# EAGLE design sdr_boosterpack (EAGLE 7.2.0)
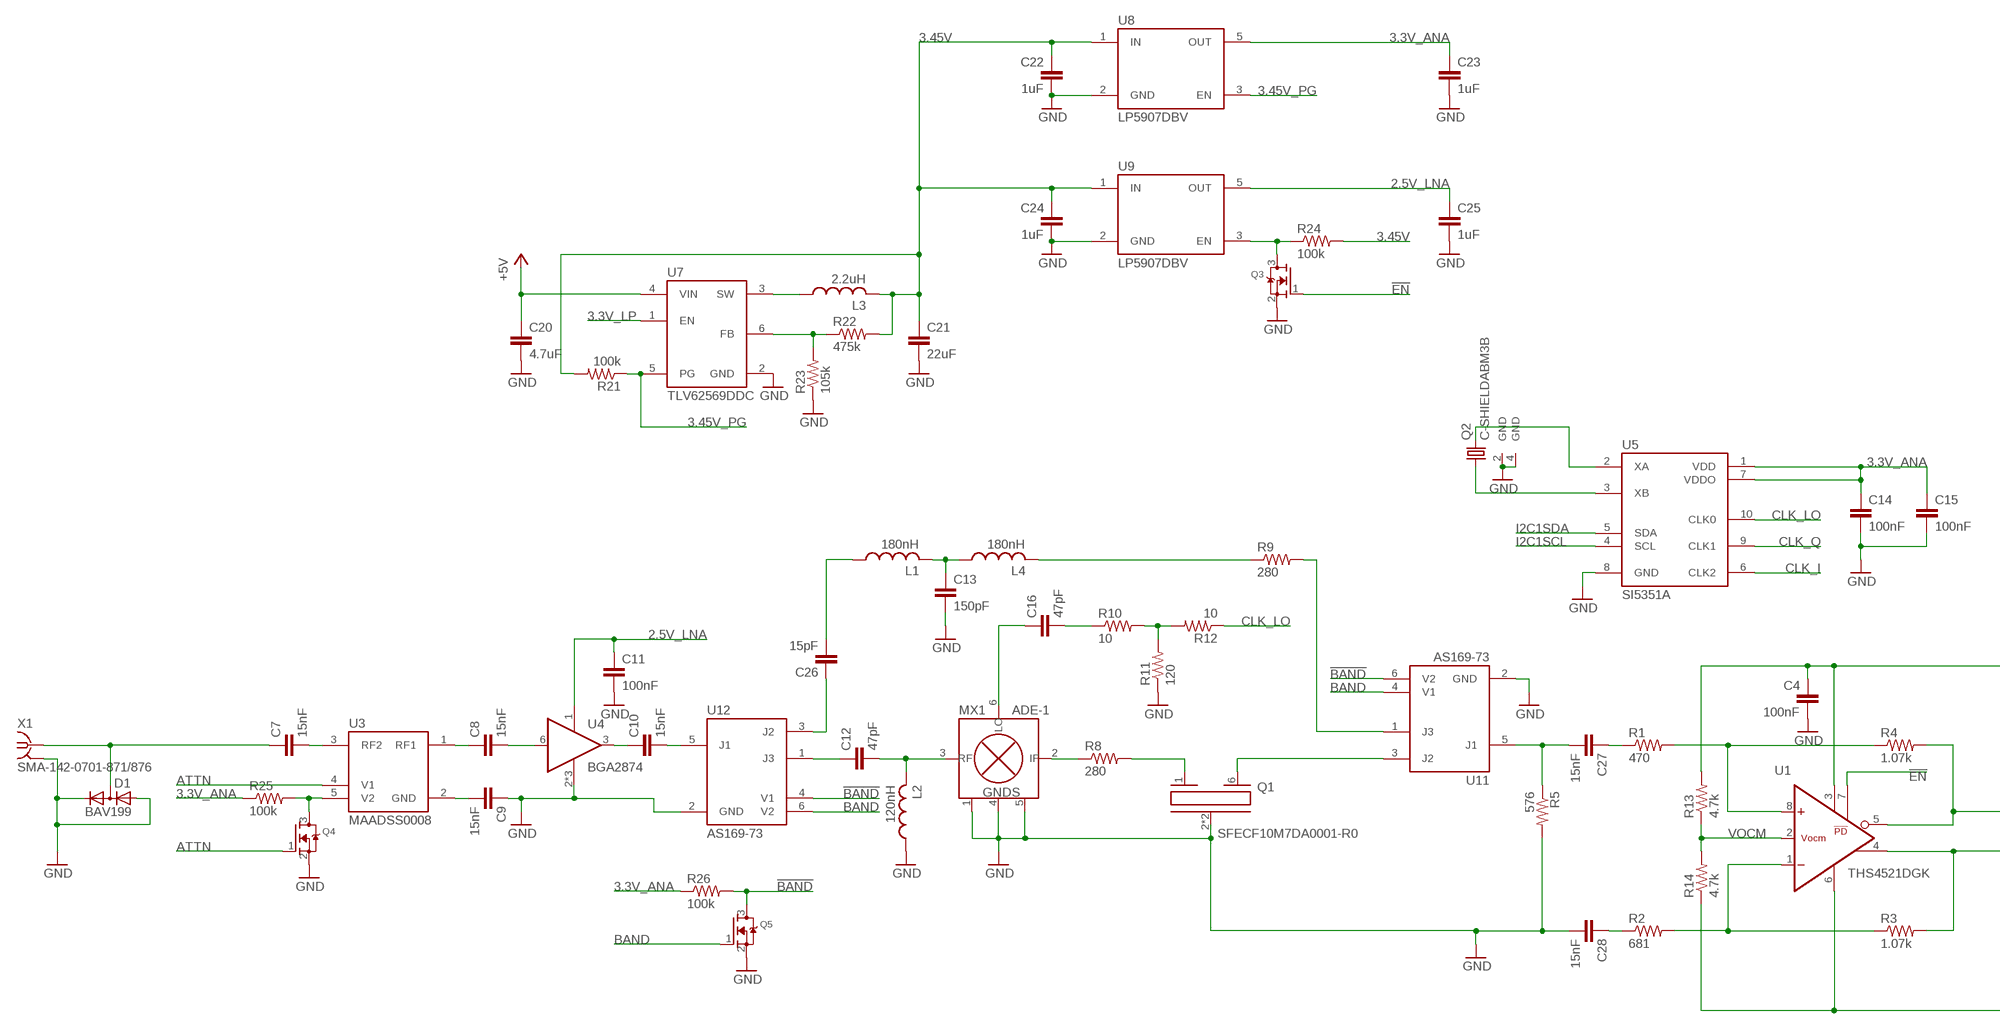
[diagram p0: schematic, sheet 1, part 1 of 2]
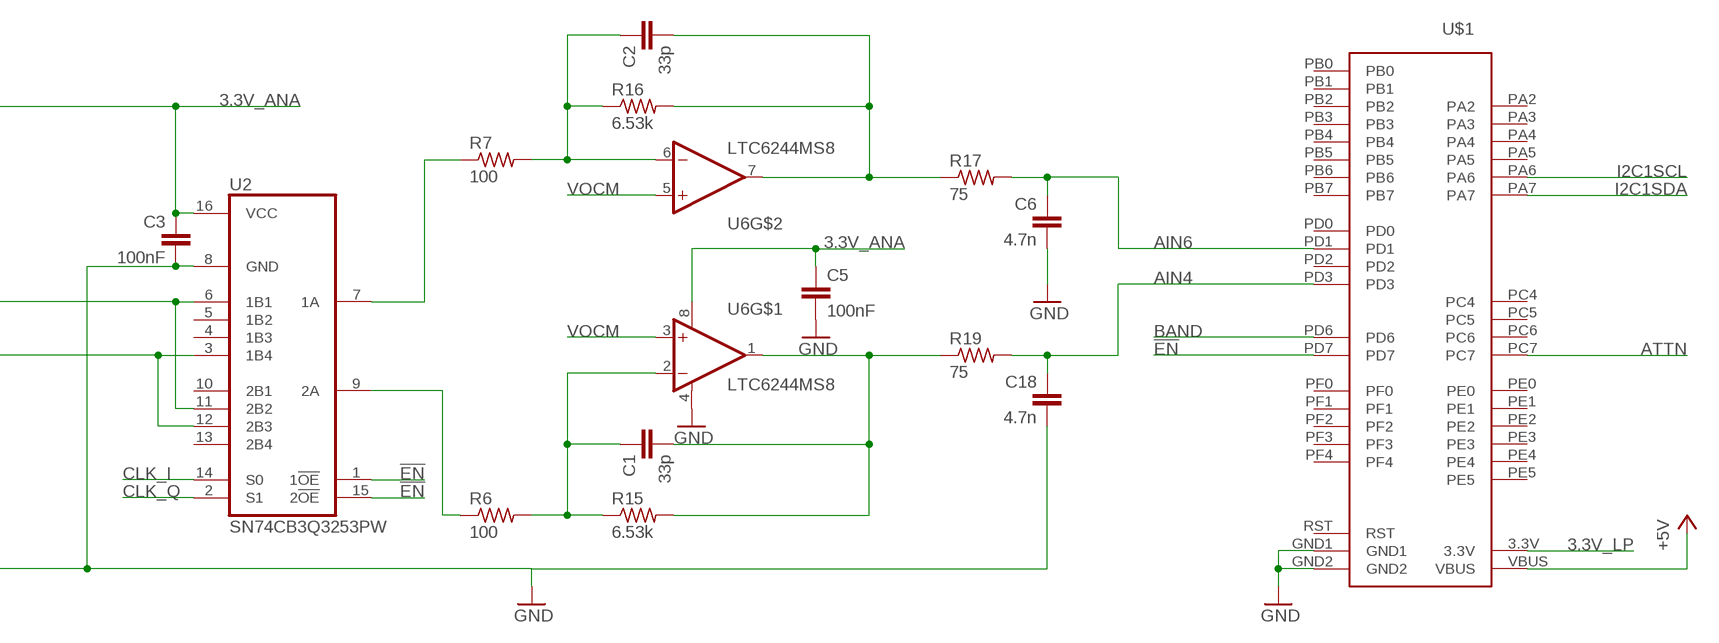
[diagram p1: schematic, sheet 1, part 2 of 2]

## Parts
C1  33p  C-EUC0603  [C0603]
C2  33p  C-EUC0603  [C0603]
C3  100nF  C-EUC0603  [C0603]
C4  100nF  C-EUC0603  [C0603]
C5  100nF  C-EUC0603  [C0603]
C6  4.7n  C-EUC0603  [C0603]
C7  15nF  C-EUC0603  [C0603]
C8  15nF  C-EUC0603  [C0603]
C9  15nF  C-EUC0603  [C0603]
C10  15nF  C-EUC0603  [C0603]
C11  100nF  C-EUC0603  [C0603]
C12  47pF  C-EUC0603  [C0603]
C13  150pF  C-EUC0603  [C0603]
C14  100nF  C-EUC0603  [C0603]
C15  100nF  C-EUC0603  [C0603]
C16  47pF  C-EUC0603  [C0603]
C18  4.7n  C-EUC0603  [C0603]
C20  4.7uF  C-EUC0805  [C0805]
C21  22uF  C-EUC0805  [C0805]
C22  1uF  C-EUC0805  [C0805]
C23  1uF  C-EUC0805  [C0805]
C24  1uF  C-EUC0805  [C0805]
C25  1uF  C-EUC0805  [C0805]
C26  15pF  C-EUC0603  [C0603]
C27  15nF  C-EUC0603  [C0603]
C28  15nF  C-EUC0603  [C0603]
D1  BAV199  [SOT23]
L1  180nH  L-US0603CS  [C0603]
L2  120nH  L-US0603CS  [C0603]
L3  2.2uH  L-USXAL4040  [XAL4040]
L4  180nH  L-US0603CS  [C0603]
MX1  ADE-1  [CD636]
Q1  SFECF10M7DA0001-R0  SFECF  [SFECF]
Q2  C-SHIELDABM3B  [ABM3B]
Q3  MOSFET-NREFLOW  [SOT23]
Q4  MOSFET-NREFLOW  [SOT23]
Q5  MOSFET-NREFLOW  [SOT23]
R1  470  R-US_R0603  [R0603]
R2  681  R-US_R0603  [R0603]
R3  1.07k  R-US_R0603  [R0603]
R4  1.07k  R-US_R0603  [R0603]
R5  576  R-US_R0603  [R0603]
R6  100  R-US_R0603  [R0603]
R7  100  R-US_R0603  [R0603]
R8  280  R-US_R0603  [R0603]
R9  280  R-US_R0603  [R0603]
R10  10  R-US_R0603  [R0603]
R11  120  R-US_R0603  [R0603]
R12  10  R-US_R0603  [R0603]
R13  4.7k  R-US_R0603  [R0603]
R14  4.7k  R-US_R0603  [R0603]
R15  6.53k  R-US_R0603  [R0603]
R16  6.53k  R-US_R0603  [R0603]
R17  75  R-US_R0603  [R0603]
R19  75  R-US_R0603  [R0603]
R21  100k  R-US_R0603  [R0603]
R22  475k  R-US_R0603  [R0603]
R23  105k  R-US_R0603  [R0603]
R24  100k  R-US_R0603  [R0603]
R25  100k  R-US_R0603  [R0603]
R26  100k  R-US_R0603  [R0603]
U1  THS4521DGK  [DGK_S-PDSO-G8]
U2  SN74CB3Q3253PW  [PW_R-PDSO-G16]
U3  MAADSS0008  [SOT23-5L]
U4  BGA2874  [SOT363_PHILIPS]
U5  SI5351A  [MSOP10]
U6  LTC6244MS8  [MSOP8]
U7  TLV62569DDC  [SOT23-6]
U8  LP5907DBV  [MF05A-M]
U9  LP5907DBV  [MF05A-M]
U11  AS169-73  [SOT23-6]
U12  AS169-73  [SOT23-6]
U$1  STELLARIS-LAUNCHPADSTELLARIS-LAUNCHPAD-XL-HALF-LENGTH  [LAUNCHPAD-XL-HALF-LENGTH]
X1  SMA-142-0701-871/876  [J502-ND-142-0701-871/876]

## Nets
2.5V_LNA: C11.1 C25.1 U4.1(V+) U9.5(OUT)
3.3V_ANA: C3.1 C4.1 C5.1 C14.1 C15.1 C23.1 R13.2 R25.1 R26.1 U1.3(V+) U2.16(VCC) U5.1(VDD) U5.7(VDDO) U6.8(V+) U8.5(OUT)
3.3V_LP: U7.1(EN) U$1.3.3V
3.45V: C21.1 C22.1 C24.1 L3.2 R21.2 R22.2 R24.2 U8.1(IN) U9.1(IN)
3.45V_PG: R21.1 U7.5(PG) U8.3(EN)
!BAND: Q5.3(D) R26.2 U11.6(V2) U12.4(V1)
!EN: Q3.1(G) U1.7(PD) U2.1(1!OE) U2.15(2!OE) U$1.PD7
+5V: C20.1 U7.4(VIN) U$1.VBUS
AIN4: C18.1 R19.2 U$1.PD3
AIN6: C6.1 R17.2 U$1.PD1
ATTN: Q4.1(G) U3.4(V1) U$1.PC7
BAND: Q5.1(G) U11.4(V1) U12.6(V2) U$1.PD6
CLK_I: U2.14(S0) U5.6(CLK2)
CLK_LO: R12.1 U5.10(CLK0)
CLK_Q: U2.2(S1) U5.9(CLK1)
GND: C3.2 C4.2 C5.2 C6.2 C9.1 C11.2 C13.2 C14.2 C15.2 C18.2 C20.2 C21.2 C22.2 C23.2 C24.2 C25.2 C28.2 D1.1(A) D1.2(C) L2.1 MX1.1(GND) MX1.4(GND) MX1.5(GND) Q1.2(GND) Q1.5(GND) Q2.2(GND) Q2.4(GND) Q3.2(S) Q4.2(S) Q5.2(S) R5.2 R11.1 R14.1 R23.1 U1.6(V-) U2.8(GND) U4.2(V-) U4.4(V-) U4.5(V-) U5.8(GND) U6.4(V-) U7.2(GND) U8.2(GND) U9.2(GND) U11.2(GND) U12.2(GND) U$1.GND1 U$1.GND2 X1.G@1 X1.G@2 X1.G@3 X1.G@4
I2C1SCL: U5.4(SCL) U$1.PA6
I2C1SDA: U5.5(SDA) U$1.PA7
N$1: R1.2 R4.1 U1.8(+IN)
N$2: Q4.3(D) R25.2 U3.5(V2)
N$3: R2.2 R3.1 U1.1(-IN)
N$4: C1.1 R6.2 R15.1 U6.2(-IN)
N$5: C27.1 R1.1
N$6: R4.2 U1.5(-OUT) U2.6(1B1) U2.11(2B2)
N$7: Q1.6(OUT) U11.3(J2)
N$8: C2.2 R16.2 R17.1 U6.7(OUT)
N$9: R6.1 U2.9(2A)
N$10: C8.2 U4.6(-IN)
N$11: R3.2 U1.4(+OUT) U2.3(1B4) U2.12(2B3)
N$12: R7.1 U2.7(1A)
N$13: C26.2 L1.1
N$14: C9.2 U3.2(GND)
N$15: C7.1 D1.3(AC) X1.1
N$16: C10.2 U12.5(J1)
N$17: C7.2 U3.3(RF2)
N$18: C8.1 U3.1(RF1)
N$19: C10.1 U4.3(OUT)
N$20: C12.1 U12.1(J3)
N$21: L4.2 R9.1
N$22: MX1.2(IF) R8.1
N$23: Q1.1(IN) R8.2
N$24: R9.2 U11.1(J3)
N$25: C13.1 L1.2 L4.1
N$26: C12.2 L2.2 MX1.3(RF)
N$29: C16.2 R10.1
N$30: R10.2 R11.2 R12.2
N$31: C16.1 MX1.6(LO)
N$32: C2.1 R7.2 R16.1 U6.6(-IN)
N$34: C1.2 R15.2 R19.1 U6.1(OUT)
N$37: Q2.3 U5.2(XA)
N$38: Q2.1 U5.3(XB)
N$40: L3.1 U7.3(SW)
N$41: C26.1 U12.3(J2)
N$42: C28.1 R2.1
N$43: R22.1 R23.2 U7.6(FB)
N$44: C27.2 R5.1 U11.5(J1)
N$48: Q3.3(D) R24.1 U9.3(EN)
VOCM: R13.1 R14.2 U1.2(VOCM) U6.3(+IN) U6.5(+IN)
Unconnected: U2.4(1B3) U2.5(1B2) U2.10(2B1) U2.13(2B4) U$1.PA2 U$1.PA3 U$1.PA4 U$1.PA5 U$1.PB0 U$1.PB1 U$1.PB2 U$1.PB3 U$1.PB4 U$1.PB5 U$1.PB6 U$1.PB7 U$1.PC4 U$1.PC5 U$1.PC6 U$1.PD0 U$1.PD2 U$1.PE0 U$1.PE1 U$1.PE2 U$1.PE3 U$1.PE4 U$1.PE5 U$1.PF0 U$1.PF1 U$1.PF2 U$1.PF3 U$1.PF4

## Power pins joined to a net without a drawn wire
RST: U$1.RST

## Library data of the parts
C1-C16 C18 C20-C28 = rcl:C-EU: CAPACITOR, European symbol
D1 = diode:BAV199: DIODE low-leakage double diode
L1-L4 = inductors:L-US: INDUCTOR, American symbol
MX1 = minickts:ADE-1: ADE-1 & ADE-1+ Level 7 Mixer, 0.5 - 500 MHz
Q1 = cerafil:SFECF
Q2 = crystal:C-SHIELD
Q3-Q5 = adafruit:MOSFET-N: N-Channel Mosfet 2N7002E - 60V 260mA SOT23 [Digikey: 2N7002ET1GOSTR-ND] - REEL BSH103 - 30V 850mA SOT23 [Digikey: 568-5013-1-ND]
R1-R17 R19 R21-R26 = rcl:R-US_: RESISTOR, American symbol
U1 = texas-1:THS4521
U2 = texas-1:SN74CB3Q3253
U3 = MAADSS0008:MAADSS0008
U4 = nxp_mmic:BGA
U5 = si5351:SI5351
U6 = opamps:LTC6244
U7 = texas-1:TLV62569
U8 U9 = LP5907:LP5907
U11 U12 = AS169-73:AS169-73
U$1 = StellarisLaunchPad_Fred:STELLARIS-LAUNCHPAD
X1 = con-coax:SMA-: SMA 50 Ohm End Launch Jack Receptacle - Round Contact Johnson Components Source: www.johnsoncomponents.com .. J502-ND.pdf; MF: JOHNSON COMPONENTS; MPN: 142-0701-871; OC_FARNELL: 1339835; OC_NEWARK: 91B6105

## Board
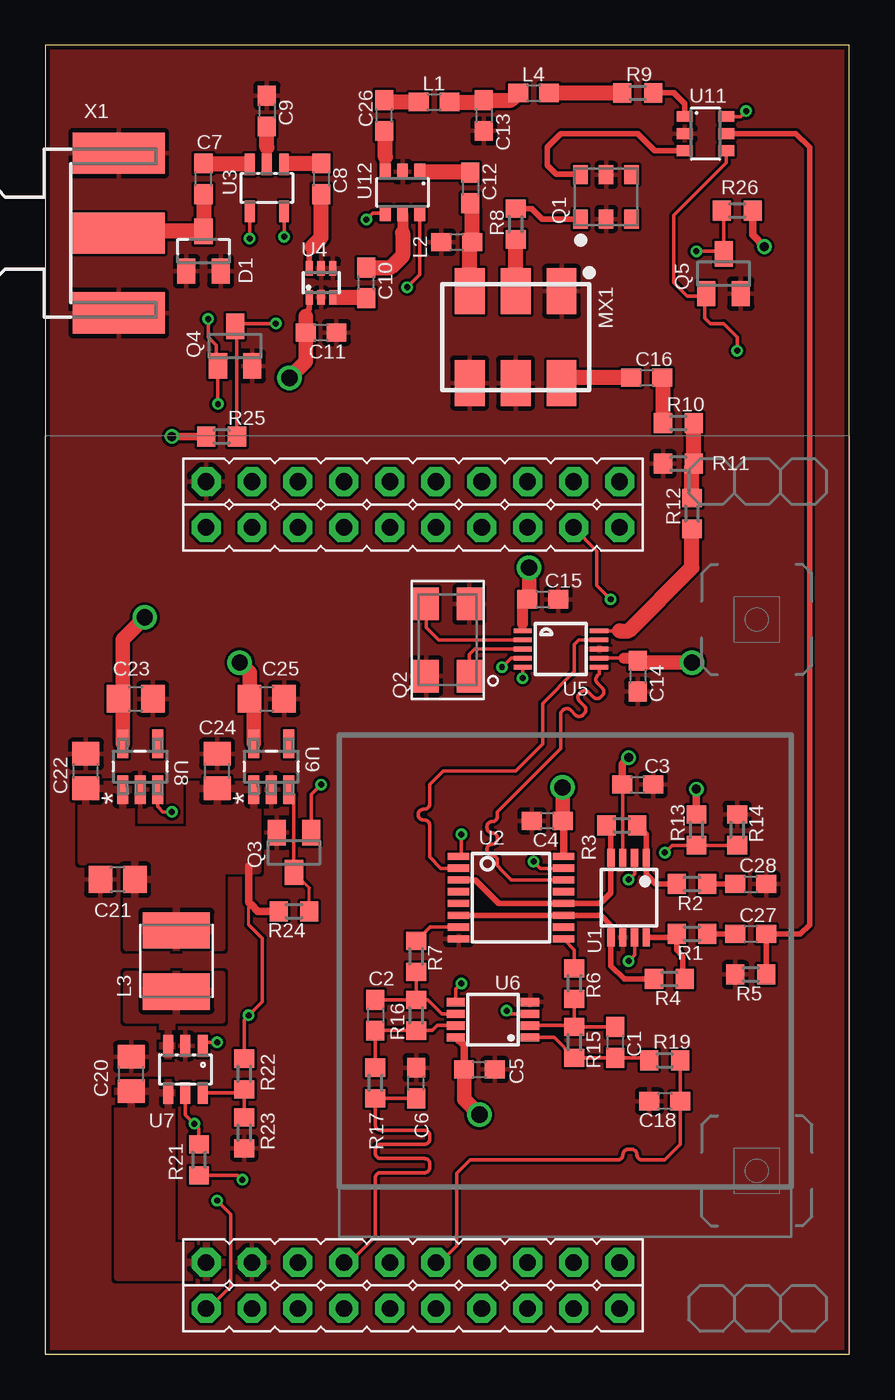
[diagram p2: board, top side]
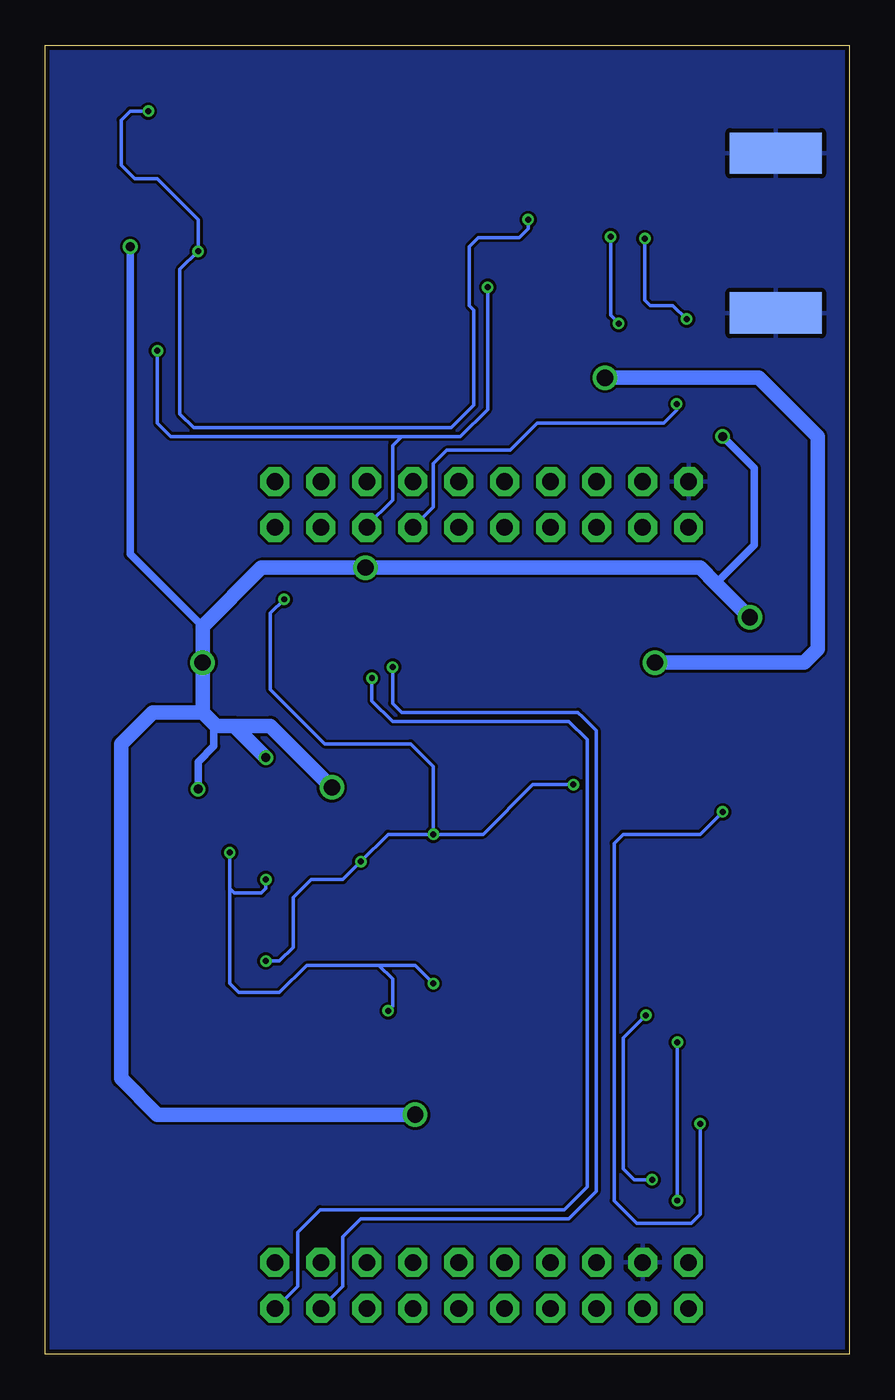
[diagram p3: board, bottom side, seen from below]

Size 44.45 x 72.39 mm. Coordinates in mm from the lower left corner, seen from the top.
Outline: 0,0 44.45,0 44.45,72.39 0,72.39 0,0
Copper layers (1*16): Top 0.035mm / dielectric 1.5mm / Bottom 0.035mm
Design rules "ITEADstudio_DRC": minimum track width 6mil, minimum drill 12mil, track to track 6mil, track to pad 6mil, pad to pad 6mil, via to via 6mil, smd to smd 0mil, copper to edge 10mil, drill to drill 10mil, minimum pad ring 10mil, minimum via ring 6mil, stop-mask expansion 2mil, vias tented up to drill 100mil, thermal gap 10mil

### Footprints (pad centres in the part's own frame; a part is rotated, then mirrored left to right if it is on the bottom)
C0603 = smd 1.1 x 1: 1 -0.85,0; 2 0.85,0
C0805 = smd 1.3 x 1.5: 1 -0.95,0; 2 0.95,0
SOT23 = smd 1 x 1.4: 1 -0.95,-1.1; 2 0.95,-1.1; 3 0,1.1
XAL4040 = smd 2 x 3.7: 1 -1.695,0; 2 1.695,0
CD636 = smd 1.651 x 2.54: 1 -2.54,-2.54; 2 0,-2.54; 3 2.54,-2.54; 4 2.54,2.54; 5 0,2.54; 6 -2.54,2.54
SFECF = smd 0.8 x 1.05: 1 -1.4,-1.225; 2 0,-1.225; 3 1.4,-1.225; 4 1.4,1.225; 5 0,1.225; 6 -1.4,1.225
ABM3B = smd 1.8 x 1.4: 1 -2,-1.2; 2 2,-1.2; 3 2,1.2; 4 -2,1.2
R0603 = smd 1 x 1.1: 1 -0.85,0; 2 0.85,0
DGK_S-PDSO-G8 = smd 0.4 x 1: 1 -0.975,-2.2; 2 -0.325,-2.2; 3 0.325,-2.2; 4 0.975,-2.2; 5 0.975,2.2; 6 0.325,2.2; 7 -0.325,2.2; 8 -0.975,2.2
PW_R-PDSO-G16 = smd 0.4 x 1.2: 1 -2.275,-2.9; 2 -1.625,-2.9; 3 -0.975,-2.9; 4 -0.325,-2.9; 5 0.325,-2.9; 6 0.975,-2.9; 7 1.625,-2.9; 8 2.275,-2.9; 9 2.275,2.9; 10 1.625,2.9; 11 0.975,2.9; 12 0.325,2.9; 13 -0.325,2.9; 14 -0.975,2.9; 15 -1.625,2.9; 16 -2.275,2.9
SOT23-5L = smd 0.55 x 1.2: 1 -0.95,-1.3; 2 0,-1.3; 3 0.95,-1.3; 4 0.95,1.3; 5 -0.95,1.3
SOT363_PHILIPS = smd 0.4 x 0.8: 1 -0.65,-0.8; 2 0,-0.8; 3 0.65,-0.8; 4 0.65,0.8; 5 0,0.8; 6 -0.65,0.8
MSOP10 = smd 0.25 x 1: 1 -1,-2.113; 2 -0.5,-2.113; 3 0,-2.113; 4 0.5,-2.113; 5 1,-2.113; 6 1,2.113; 7 0.5,2.113; 8 0,2.113; 9 -0.5,2.113; 10 -1,2.113
MSOP8 = smd 0.45 x 1: 1 -0.975,-2.05; 2 -0.325,-2.05; 3 0.325,-2.05; 4 0.975,-2.05; 5 0.975,2.05; 6 0.325,2.05; 7 -0.325,2.05; 8 -0.975,2.05
SOT23-6 = smd 0.55 x 1.2: 1 -0.95,-1.3; 2 0,-1.3; 3 0.95,-1.3; 4 0.95,1.3; 5 0,1.3; 6 -0.95,1.3
MF05A-M = smd 1.575 x 0.61: 1 -1.27,0.965; 2 -1.27,0; 3 -1.27,-0.965; 4 1.27,-0.965; 5 1.27,0.965
SOT23-6' = smd 0.6 x 0.9: 1 -0.95,-1.15; 2 0,-1.15; 3 0.95,-1.15; 4 0.95,1.15; 5 0,1.15; 6 -0.95,1.15
LAUNCHPAD-XL-HALF-LENGTH = drill 0.914 pad 1.6 octagon: 3.3V 8.89,2.54; GND1 11.43,5.08; GND2 8.89,48.26; PA2 31.75,48.26; PA3 29.21,48.26; PA4 26.67,48.26; PA5 26.67,2.54; PA6 29.21,2.54; PA7 31.75,2.54; PB0 13.97,2.54; PB1 16.51,2.54; PB2 11.43,48.26; PB3 13.97,45.72; PB4 24.13,2.54; PB5 11.43,2.54; PB6 24.13,48.26; PB7 21.59,48.26; PC4 16.51,45.72; PC5 19.05,45.72; PC6 21.59,45.72; PC7 24.13,45.72; PD0 13.97,5.08; PD1 16.51,5.08; PD2 19.05,5.08; PD3 21.59,5.08; PD6 26.67,45.72; PD7 29.21,45.72; PE0 13.97,48.26; PE1 24.13,5.08; PE2 26.67,5.08; PE3 29.21,5.08; PE4 19.05,2.54; PE5 21.59,2.54; PF0 16.51,48.26; PF1 31.75,5.08; PF2 8.89,45.72; PF3 11.43,45.72; PF4 31.75,45.72; RST 19.05,48.26; VBUS 8.89,5.08
J502-ND-142-0701-871/876 = smd 5.08 x 2.286: 1 2.565,0; G@1 2.565,4.42; G@2 2.565,-4.42 | smd 5.08 x 2.286 bottom: G@3 2.565,4.42; G@4 2.565,-4.42

### Placement (x,y rotation side)
C1  31.5,17.25 270 top
C2  18.25,18.75 270 top
C3  32.75,31.5 0 top
C4  27.75,29.5 180 top
C5  24,15.75 0 top
C6  20.5,15 90 top
C7  8.75,65 90 top
C8  15.25,65 270 top
C9  12.25,68.75 270 top
C10  17.75,59.25 90 top
C11  15.25,56.5 0 top
C12  23.5,64.5 270 top
C13  24.25,68.5 270 top
C14  32.75,37.5 270 top
C15  27.5,41.75 0 top
C16  33.25,54 0 top
C18  34.25,14 180 top
C20  4.75,15.5 90 top
C21  4,26.25 180 top
C22  2.25,32.25 90 top
C23  5,36.25 0 top
C24  9.5,32.25 90 top
C25  12.25,36.25 0 top
C26  18.75,68.5 90 top
C27  39,23.25 0 top
C28  39,26 0 top
D1  8.75,61 0 top
L1  21.5,69.25 0 top
L2  22.75,61.5 0 top
L3  7.25,21.75 90 top
L4  27,69.75 0 top
MX1  26,56.25 180 top
Q1  31,64 0 top
Q2  22.25,39.5 90 top
Q3  13.75,27.75 180 top
Q4  10.5,55.75 0 top
Q5  37.5,59.75 0 top
R1  35.75,23.25 180 top
R2  35.75,26 180 top
R3  31.88,29.25 180 top
R4  34.5,20.75 180 top
R5  39,21 180 top
R6  29.25,20.5 270 top
R7  20.5,22 270 top
R8  26,62.5 90 top
R9  32.75,69.75 0 top
R10  35,51.5 0 top
R11  35,49.25 0 top
R12  35.75,46.5 90 top
R13  36,29 90 top
R14  38.25,29 270 top
R15  29.25,17.25 270 top
R16  20.5,18.75 270 top
R17  18.25,15 270 top
R19  34.25,16.25 0 top
R21  8.5,10.75 270 top
R22  11,15.5 90 top
R23  11,12.25 90 top
R24  13.75,24.5 180 top
R25  9.75,50.75 0 top
R26  38.25,63.25 180 top
U1  32.25,25.25 180 top
U2  25.75,25.25 270 top
U3  12.25,64.5 180 top
U4  15.25,59.25 0 top
U5  28.5,39 270 top
U6  24.75,18.5 90 top
U7  7.75,15.75 180 top
U8  5.25,32.5 90 top
U9  12.5,32.5 90 top
U11  AS169-73  [SOT23-6']  36.5,67.5 270 top
U12  AS169-73  [SOT23-6']  19.75,64.25 180 top
U$1  0,0 0 top
X1  1.5,62 0 top

### Tracks (layer width: path | path; a pad name or v marks a point on that pad's centre or on a via)
2.5V_LNA  (via drill 0.9)
  Top 0.305: U4.1 14.6,57.85 14.4,57.4
  Top 0.813: U9.5 11.54,36.02 C25.1 11.3,37.7 v10.75,38.25 | v13.5,54 14.4,54.9 C11.1 14.4,57.4
  Bottom 0.813: v10.75,38.25 2.5,38.25 1.75,39 1.75,50.75 5,54 v13.5,54
3.3V_ANA  (via drill 0.5, 0.9)
  Top 0.203: U5.7 32,38.5 | U1.3 31.93,31.48 | U5.1 26.39,40.39
  Top 0.3: 31.93,31.48 C3.1
  Top 0.406: C3.1 31.9,32.65 v32.25,33 | R13.2 v36,31.25 | C5.1 23.15,17.07 U6.8 | U2.16 28.65,29.45 C4.1 | R26.1 39.1,61.9 v39.75,61.25 | v7,50.75 R25.1
  Top 0.61: 32,38.5 32.6,38.5 C14.1 | 26.39,40.39 26.39,41.51 26.62,41.75 C15.1
  Top 0.813: U8.5 4.29,36.02 | 4.29,36.02 C23.1 | 4.29,36.02 4.29,39.53 v5.5,40.75 | v35.75,38.25 32.85,38.25 C14.1 | C4.1 v28.6,31.35 | C5.1 23.15,14.1 v24,13.25 | v26.75,43.5 26.75,41.85 C15.1
  Bottom 0.406: v36,31.25 36,32.75 35.12,33.62 35.12,34.88 35.38,35.12 | v39.75,61.25 39.75,44.25 35.75,40.25 | v7,50.75 5.25,49 5.25,44.75 7.38,42.62
  Bottom 0.813: v5.5,40.75 7.38,42.62 8.25,43.5 v26.75,43.5 32.5,43.5 35.75,40.25 v35.75,38.25 35.75,35.75 | 35.75,35.75 35.75,35.5 35.38,35.12 35,34.75 34,34.75 | v24,13.25 38.25,13.25 40.25,15.25 40.25,33.75 38.5,35.5 36,35.5 35.75,35.75 | v32.25,33 34,34.75 | 34,34.75 32,34.75 v28.6,31.35
3.3V_LP  (via drill 0.33)
  Top 0.203: v9.5,17.25 8.9,17.25 U7.1 | U$1.3.3V 9.04,2.54 10.25,3.75 10.25,7.75 v9.5,8.5
  Bottom 0.203: v9.5,8.5 v9.5,17.25
3.45V  (via drill 0.33)
  Top 0.152: 11.25,23.75 11.25,24.75 11.38,24.88
  Top 0.203: R22.2 11,18.5 v11.25,18.75 12,19.5 12,23 11.25,23.75 | R21.2 10.65,9.9 v10.9,9.65
  Top 0.406: R24.2 11.75,24.5 11.38,24.88 11.25,25 11.25,27
  Bottom 0.203: v10.9,9.65 11.9,9.65 12.5,10.25 12.5,17.5 v11.25,18.75
  pour Top: 4.5,22.5 9.75,22.5 9.75,26.75 11.75,26.75 11.75,31.5 8,31.5 8,29 4.75,29 4.75,31.5 2,31.5 2,27.25 4.5,27.25
3.45V_PG  (via drill 0.33)
  Top 0.203: U8.3 6.21,30.29 6.5,30 v7,30 | R21.1 8.5,12.5 v8.25,12.75 7.75,13.25 U7.5
  Bottom 0.203: v7,30 8.25,28.75 12.5,28.75 13,28.25 13,8.5 11.75,7.25 8.75,7.25 8.25,7.75 v8.25,12.75
!BAND  (via drill 0.33)
  Top 0.203: U11.6 38.45,68.45 v38.75,68.75 | 18.8,62.8 U12.4 18.1,63.1 v17.75,62.75 | v36,61 37.35,61 Q5.3 37.5,63.15 R26.2
  Bottom 0.203: v17.75,62.75 17.75,62.25 18.25,61.75 20.5,61.75 21,61.25 21,58 20.75,57.75 20.75,52.5 22,51.25 36.25,51.25 37,52 37,60 v36,61 36,62.75 38.25,65 39.5,65 40.25,65.75 40.25,68.25 39.75,68.75 v38.75,68.75
!EN  (via drill 0.33)
  Top 0.203: U2.15 27.38,26.88 v27,27.25 | v23,28.75 23,27.68 U2.1 | U1.7 32.58,22.07 v32.25,21.75 | Q3.1 14.7,30.95 v15.25,31.5 | v31.25,41.75 30.5,42.5 30.5,44.43 U$1.PD7
  Bottom 0.203: v23,28.75 25.5,28.75 v27,27.25 28,26.25 29.75,26.25 30.75,25.25 30.75,22.5 31.5,21.75 v32.25,21.75 | v23,28.75 20.25,28.75 17.5,31.5 v15.25,31.5 | v31.25,41.75 32,41 32,36.75 29,33.75 24.25,33.75 23,32.5 v23,28.75
+5V
  pour Top: 7,15 7,6 9.75,6 9.75,4.25 4,4.25 4,15
AIN4
  Top 0.203: U$1.PD3 21.83,5.08 22.75,6 22.75,10 23.5,10.75 31.64,10.75 arc90 31.94,11.04 arc-90 32.23,11.33 32.42,11.33 arc-90 32.71,11.04 arc90 33,10.75 34.25,10.75 35.1,11.6 C18.1 R19.2
AIN6
  Top 0.203: U$1.PD1 16.83,5.08 18.25,6.5 18.25,9.75 arc-90 18.54,10.04 20.96,10.04 arc90 21.26,10.33 21.26,10.53 arc90 20.96,10.83 18.54,10.83 arc-90 18.25,11.12 18.25,11.32 arc-90 18.54,11.61 20.96,11.61 arc90 21.26,11.9 21.26,12.1 arc90 20.96,12.39 18.54,12.39 arc-90 18.25,12.69 R17.2 C6.1
ATTN  (via drill 0.33)
  Top 0.203: v9.55,52.55 Q4.1 9.45,54.75 9.45,55.8 9,56.25 v9,57.25 | U3.4 v11.3,61.7
  Bottom 0.203: v9.55,52.55 9.55,52.2 10.25,51.5 17.25,51.5 18.75,50 22.25,50 23,49.25 23,46.85 U$1.PC7 | v11.3,61.7 11.3,58.3 11,58 9.75,58 v9,57.25
BAND  (via drill 0.33)
  Top 0.203: U12.6 20.7,59.7 v20,59 | U11.4 37.65,65.9 34.75,63 34.75,59.25 35.5,58.5 36.4,58.5 Q5.1 36.45,58.75 36.45,57.3 36.75,57 37.5,57 38.25,56.25 v38.25,55.5
  Bottom 0.203: 24.75,50.75 21.5,50.75 20,52.25 v20,59 | 24.75,50.75 37.5,50.75 38.25,51.5 v38.25,55.5 | U$1.PD6 26.67,45.83 25.25,47.25 25.25,50.25 24.75,50.75
CLK_I
  Top 0.203: U2.14 25.75,26.23 25.25,26.73 25,27.02 25,27.29 arc90 24.71,27.58 arc-90 24.42,27.88 24.42,27.92 arc-90 24.71,28.21 arc90 25,28.5 25,28.54 arc90 24.71,28.83 arc-90 24.42,29.12 24.42,29.17 arc-90 24.71,29.46 arc90 25,29.75 25,30 28.5,33.5 28.5,35.5 28.62,35.62 arc-90 29.04,35.62 29.31,35.35 arc90 29.72,35.35 29.8,35.44 arc90 29.8,35.85 29.53,36.12 arc-90 29.53,36.53 29.61,36.62 arc-90 30.03,36.62 30.3,36.34 arc90 30.71,36.34 30.79,36.42 arc90 30.79,36.84 30.52,37.11 arc-90 30.52,37.52 30.61,37.61 U5.6
CLK_LO
  Top 0.203: U5.10 31.75,40
  Top 0.83: R12.1 35.75,43.5 32.25,40 31.75,40
CLK_Q
  Top 0.203: U2.2 21.88,26.88 21.25,27.5 21.25,29.25 arc90 20.96,29.54 20.91,29.54 arc-90 20.61,29.83 20.61,29.85 arc-90 20.91,30.14 20.96,30.14 arc90 21.25,30.43 21.25,31.5 22,32.25 26,32.25 27.5,33.75 27.5,36 29.25,37.75 29.25,39.25 29.5,39.5 U5.9
GND
  Bottom 0.3: X1.G@2 4.07,58.19 4,58.25 4,57.65 X1.G@2
  pour Top (rank 2): 0,0 44.5,0 44.5,72.5 0,72.5
  pour Bottom (rank 2): 0,0 44.5,0 44.5,72.5 0,72.5
I2C1SCL  (via drill 0.33)
  Top 0.203: 25.5,38.25 v25.25,38 25.75,38.5 U5.4
  Bottom 0.203: U$1.PA6 28,3.75 28,6.5 27,7.5 15.5,7.5 14,9 14,34.5 14.62,35.12 14.75,35.25 15,35.5 24.75,35.5 25.25,36 v25.25,38
I2C1SDA  (via drill 0.33)
  Top 0.203: U5.5 v26.39,37.39
  Bottom 0.203: U$1.PA7 31.71,2.54 30.5,3.75 30.5,6.75 29.25,8 15.75,8 14.5,9.25 14.5,34 15.5,35 25.25,35 26.39,36.14 v26.39,37.39
N$1
  Top 0.3: U1.8 34.7,23.05 R1.2 34.9,22.35 35.25,22 35.25,20.85 R4.1
N$2  (via drill 0.33)
  Top 0.203: U3.5 v13.2,61.8 | R25.2 10.6,56.75 Q4.3 10.65,57 v12.75,57
  Bottom 0.203: v13.2,61.8 13.2,57.45 v12.75,57
N$3
  Top 0.3: R3.1 33.23,28.75 U1.1 33.23,26.52 33.75,26 R2.2
N$4
  Top 0.203: C1.1 R15.1 | U6.2 29.18,18.18 R15.1 | R15.1 R6.2
N$5
  Top 0.3: R1.1 C27.1
N$6
  Top 0.3: R4.2 32,20.75 31.27,21.48 U1.5 31.27,23.73 30.73,24.27 U2.11 U2.6
N$7
  Top 0.3: Q1.6 29.57,65.25 28.25,65.25 27.75,65.75 27.75,66.75 28.5,67.5 32.75,67.5 33.7,66.55 U11.3
N$8
  Top 0.203: U6.7 21.68,18.18 21.4,17.9 R16.2 C2.2 R17.1
N$9
  Top 0.203: R6.1 29.25,22.38 U2.9
N$10
  Top 0.305: U4.6 14.6,61.1 14.75,61.25
  Top 0.83: 14.75,61.25 15.25,61.75 C8.2
N$11
  Top 0.3: R3.2 31.27,29 U1.4 31.27,25.52 30.68,24.93 U2.12 25.07,24.93 23.77,26.23 U2.3
N$12
  Top 0.203: U2.7 21.27,23.62 R7.1
N$13
  Top 0.83: L1.1 18.85,69.25 C26.2
N$14
  Top 0.406: U3.2 12.25,66.75
  Top 0.83: 12.25,66.75 C9.2
N$15
  Top 0.83: X1.1 4.17,62.1 D1.3 C7.1
N$16
  Top 0.61: U12.5 19.75,62
  Top 0.83: 19.75,62 19.75,60.75 19.1,60.1 C10.2
N$17
  Top 0.406: 11.15,65.85 11.25,65.85 U3.3 10.65,65.8 11.1,65.85
  Top 0.83: C7.2 11.1,65.85
N$18
  Top 0.406: 13.4,65.85 13.25,65.85 U3.1
  Top 0.83: C8.1 13.4,65.85
N$19
  Top 0.305: U4.3 16.2,58.45
  Top 0.83: 16.2,58.45 17.7,58.45 C10.1
N$20
  Top 0.61: U12.1 20.85,65.4
  Top 0.83: 20.85,65.4 23.2,65.4 C12.1
N$21
  Top 0.83: L4.2 R9.1
N$22
  Top 0.83: MX1.2 R8.1
N$23
  Top 0.3: Q1.1 27.48,62.77 26.9,63.35 R8.2
N$24
  Top 0.3: R9.2 34.75,69.75 35.35,69.15 U11.1
N$25
  Top 0.83: L1.2 24.15,69.25 C13.1 25.75,69.35 L4.1
N$26
  Top 0.83: MX1.3 23.46,61.36 L2.2 23.6,63.3 C12.2
N$29
  Top 0.83: R10.1 34.15,53.95 C16.2
N$30
  Top 0.83: R10.2 R11.2 35.75,49.15 R12.2
N$31
  Top 0.83: C16.1 28.83,54 MX1.6
N$32
  Top 0.203: R16.1 R7.2 | C2.1 R16.1 | U6.6 21.93,18.82 21.15,19.6 R16.1
N$34
  Top 0.203: U6.1 28.12,17.52 R15.2 C1.2 33.25,16.4 R19.1
N$37
  Top 0.203: U5.2 21.75,39.5 21.05,40.2 Q2.3
N$38
  Top 0.203: Q2.1 23.45,38.7 23.75,39 U5.3
N$40
  pour Top: 6.5,16.5 6.5,18.5 4.5,18.5 4.5,21 9.75,21 9.75,18.5 7,18.5 7,16.5
N$41
  Top 0.61: U12.3 18.8,66.2
  Top 0.83: 18.8,66.2 18.8,67.6 C26.1
N$42
  Top 0.3: R2.1 C28.1
N$43
  Top 0.203: U7.6 10.8,14.45 R22.1 R23.2
N$44
  Top 0.3: U11.5 41.5,67.5 42.25,66.75 42.25,23.75 41.75,23.25 C27.2 R5.1
N$48
  Top 0.152: R24.1 14.6,25.8 Q3.3
  Top 0.203: Q3.3 13.75,30.95 U9.3
VOCM  (via drill 0.33)
  Top 0.203: U1.2 32.58,26.57 v32.25,26.25 | R14.2 R13.1 34.65,28.15 v34.25,27.75 | U6.5 22.7,20.2 v23,20.5 | U6.3 25.68,18.82 v25.5,19
  Bottom 0.203: v32.25,26.25 32.25,25.75 32.5,25.5 34,25.5 34.25,25.75 | 34.25,25.75 v34.25,27.75 | v23,20.5 24,21.5 26,21.5 | 26,21.5 30,21.5 31.5,20 33.75,20 34.25,20.5 34.25,25.75 | v25.5,19 25.25,19.25 25.25,20.75 26,21.5